# Altium schematic sheet 4_RFM95W.SchDoc
size A4; SheetNumber: 5; SheetTotal: 6
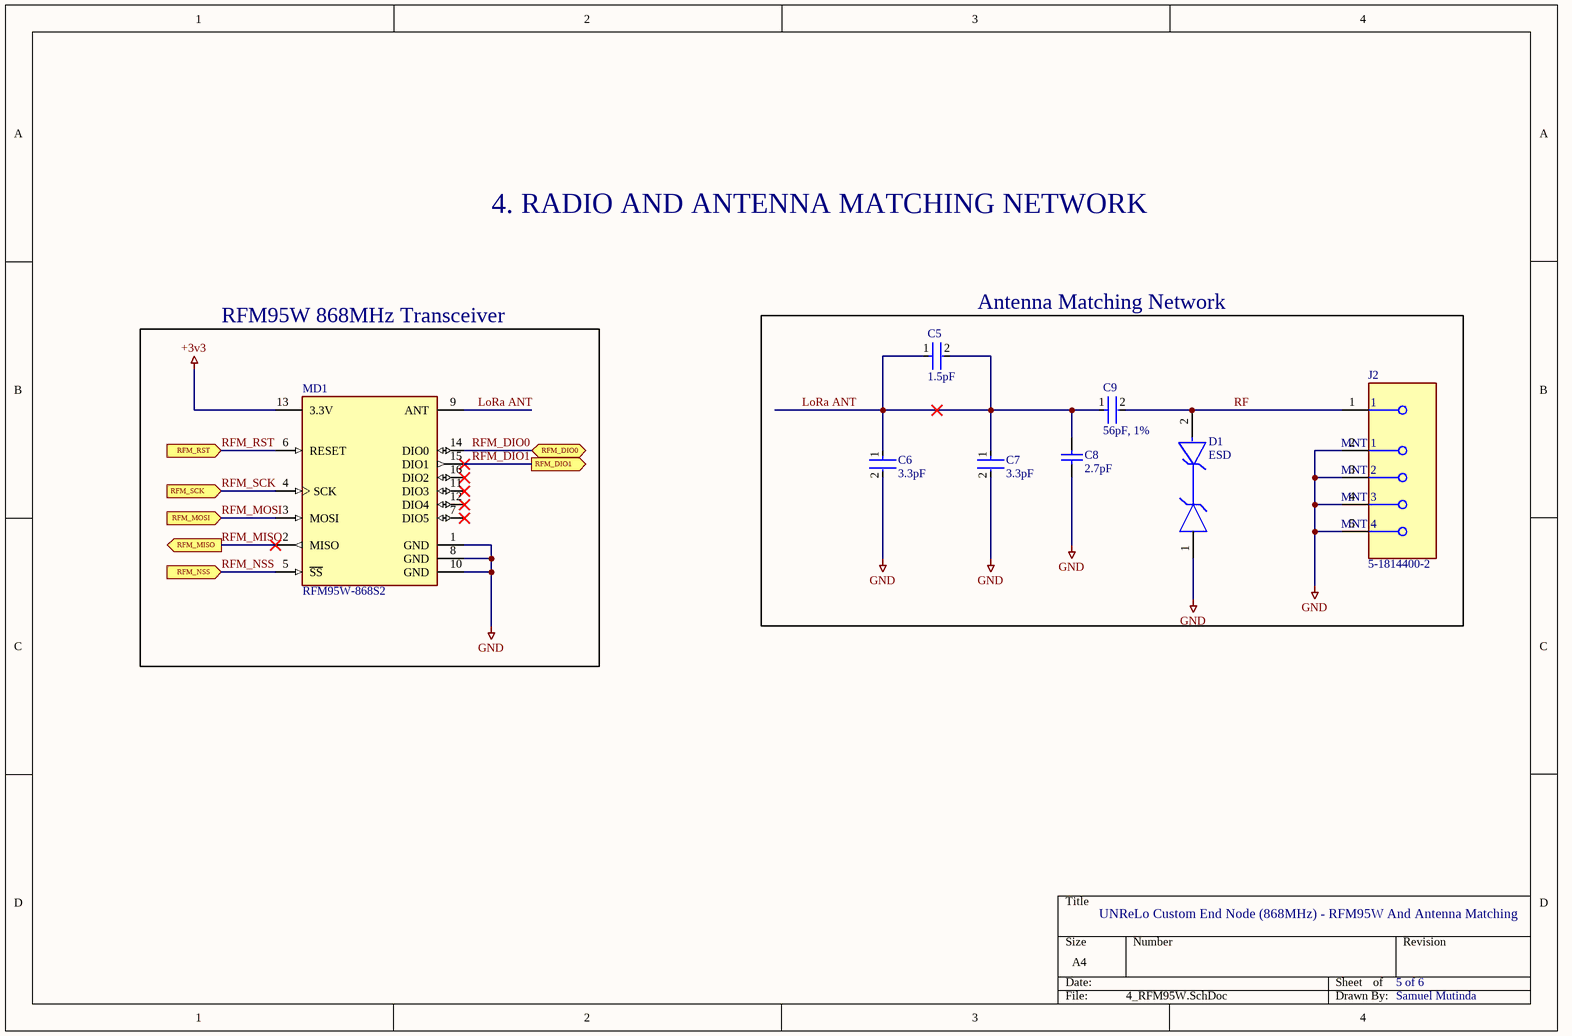
[diagram p0: 4_RFM95W.SchDoc]

## Parts
C5  1.5pF  [FP-GJM155-0_05-IPC_C]
C6  3.3pF  [FP-C0603C-CF-MFG]
C7  3.3pF  [FP-C0603C-CF-MFG]
C8  2.7pF  [CAPC1006X50X20ML10T10]
C9  56pF, 1%  [FP-C0603C-CF-MFG]
D1  ESD  [FP-711AM-CA-MFG]
J2  5-1814400-2  [FP-5-1814400-2-MFG]
MD1  RFM95W-868S2  [FP-RFM95W-868S2-MFG]

## Blocks framed on the sheet
RFM95W 868MHz Transceiver: MD1
Antenna Matching Network: C5-C9 D1 J2

## Ports
RFM_DIO0 (bidir), RFM_DIO1 (out), RFM_MISO (out), RFM_MOSI (in), RFM_NSS (in), RFM_RST (in), RFM_SCK (in)

## Nets
+3v3: MD1.13(3.3V)
GND: C6.2 C7.2 C8.1 D1.1 J2.2(MNT_1) J2.3(MNT_2) J2.4(MNT_3) J2.5(MNT_4) MD1.1(GND) MD1.8(GND) MD1.10(GND)
LoRa ANT: C5.1 C5.2 C6.1 C7.1 C8.2 C9.1 MD1.9(ANT)
RF: C9.2 D1.2 J2.1
RFM_DIO0: MD1.14(DIO0) ; port RFM_DIO0
RFM_DIO1: MD1.15(DIO1) ; port RFM_DIO1
RFM_MISO: MD1.2(MISO) ; port RFM_MISO
RFM_MOSI: MD1.3(MOSI) ; port RFM_MOSI
RFM_NSS: MD1.5(~{SS}) ; port RFM_NSS
RFM_RST: MD1.6(RESET) ; port RFM_RST
RFM_SCK: MD1.4(SCK) ; port RFM_SCK

Not connected (* = marked no-connect by the designer): MD1 7(DIO5)* 11(DIO3)* 12(DIO4)* 16(DIO2)*

## Notes on the sheet
- 4. RADIO AND ANTENNA MATCHING NETWORK
- UNReLo Custom End Node (868MHz) - RFM95W And Antenna Matching
- 5 of 6
- Samuel Mutinda

## Library data of the parts
C5 = CMP-2008-03820-2: Multi-Layer Ceramic Capacitor 1.5pF C0G  ±0.1pF 0402 Paper T/R; Manufacturer 1: KEMET; Temperature Coefficient: 30ppm/°C; Voltage Rating: 50V; Name: CBR04C159B5GAC; Depth: 0.5mm; Case Code (Imperial): 0402; Package Quantity: 10000; Length: 1mm; Number of Pins: 2; Max Operating Temperature: 125°C; Mount: Surface Mount; Construction: Flat; Thickness: 0.022inch; Series: GJM; Packaging: Tape and Reel; Radiation Hardening: No; REACH SVHC: No SVHC; Case/Package: 0402; Lead Free: Lead Free; Voltage Rating (DC): 50V; Min Operating Temperature: -55°C; Dielectric: C0G; Termination: SMD/SMT; Width: 0.5mm; Capacitance: 1.5pF; Lead Pitch: 0.3mm; Case Code (Metric): 1005; Voltage: 50V; Height: 0.5mm; Manufacturer Part Number 1: CBR04C159B5GAC; Supplier 1: Digi-Key; Supplier Part Number 1: 399-CBR04C159B5GACCT-ND; Supplier Unit Price 1: $0.17
C6 = CMP-1035-00238-3: CAP CER 3.3PF 50V NP0 0603; Manufacturer 1: KEMET; Tolerance: 0.25 pF; Material: Ceramic; Temperature Characteristic: C0G; Automotive Grade: Grade 1; Temperature Coefficient: 30ppm/°C; Name: C0603C339C5GACTU; Height: 0.87mm; Category: Cap; Automotive: Yes; Voltage Rating: 50 V; Capacitance: 3.3 pF; ComponentLink2Description: Datasheet; Octopart: https://octopart.com/c0603c339c5gactu-kemet-3701205; Temperature Range Low: -55°C; Device Class L3: Ceramic Capacitors; Package: C0603C-CF; Temperature: -55°C to +125°C; Digikey Description: CAP CER 3.3PF 50V NP0 0603; Temperature Range High: +125°C; ComponentLink2URL: https://api.kemet.com/component-edge/download/datasheet/C0603C100J5GACAUTO.pdf; Device Class L1: Passive Components; Value: 3.3 pF; RoHS: TRUE; Lead Free: Yes; Mouser Description: Multilayer Ceramic Capacitors MLCC - SMD/SMT 50volts 3.3pF C0G 0.25%; Device Class L2: Capacitors; Manufacturer Part Number 1: C0603C339C5GACTU; Supplier 1: Digi-Key; Supplier Part Number 1: 399-C0603C339C5GAC7867CT-ND; Supplier Unit Price 1: $0.34
C7 = CMP-1035-00238-3: CAP CER 3.3PF 50V NP0 0603; Manufacturer 1: KEMET; Tolerance: 0.25 pF; Material: Ceramic; Temperature Characteristic: C0G; Automotive Grade: Grade 1; Temperature Coefficient: 30ppm/°C; Name: C0603C339C5GAC7867; Height: 0.87mm; Category: Cap; Automotive: Yes; Voltage Rating: 50 V; Capacitance: 3.3 pF; ComponentLink2Description: Datasheet; Octopart: https://octopart.com/c0603c339c5gactu-kemet-3701205; Temperature Range Low: -55°C; Device Class L3: Ceramic Capacitors; Package: C0603C-CF; Temperature: -55°C to +125°C; Digikey Description: CAP CER 3.3PF 50V NP0 0603; Temperature Range High: +125°C; ComponentLink2URL: https://api.kemet.com/component-edge/download/datasheet/C0603C100J5GACAUTO.pdf; Device Class L1: Passive Components; Value: 3.3 pF; RoHS: TRUE; Lead Free: Yes; Mouser Description: Multilayer Ceramic Capacitors MLCC - SMD/SMT 50volts 3.3pF C0G 0.25%; Device Class L2: Capacitors; Manufacturer Part Number 1: C0603C339C5GAC7867; Supplier 1: Digi-Key; Supplier Part Number 1: 399-C0603C339C5GAC7867CT-ND; Supplier Unit Price 1: $0.34
C8 = CMP-2008-04788-1: Manufacturer: AVX Interconnect / Elco; Manufacturer 1: KEMET; Name: CBR04C279B5GAC; Manufacturer Part Number 1: CBR04C279B5GAC; Supplier 1: Digi-Key; Supplier Part Number 1: 399-14751-1-ND; Supplier Unit Price 1: $0.15
C9 = CMP-2006-03385-2: CAP CER 56PF 50V 1% NP0 0603; Manufacturer 1: KEMET; Material: Ceramic; Tolerance: 0.01; Temperature Coefficient: 30ppm/°C; Automotive Grade: Grade 1; Temperature Characteristic: C0G; Name: C0603C560F5GAC7867; Capacitance: 56 pF; ComponentLink2Description: Datasheet; Package: C0603C-CF; Lead Free: Yes; Digikey Description: CAP CER 56PF 50V 1% NP0 0603; Mouser Description: Multilayer Ceramic Capacitors MLCC - SMD/SMT 50volts 56pF C0G 1%; Value: 56 pF; Temperature Range High: +125°C; Category: Cap; Temperature Range Low: -55°C; RoHS: TRUE; ComponentLink2URL: https://api.kemet.com/component-edge/download/datasheet/C0603C100J5GACAUTO.pdf; Device Class L1: Passive Components; Device Class L2: Capacitors; Temperature: -55°C to +125°C; Device Class L3: Ceramic Capacitors; Height: 0.87mm; Octopart: https://octopart.com/c0603c560f5gactu-kemet-9143760; Automotive: Yes; Voltage Rating: 50 V; Manufacturer Part Number 1: C0603C560F5GAC7867; Supplier 1: Digi-Key; Supplier Part Number 1: 399-C0603C560F5GAC7867CT-ND; Supplier Unit Price 1: $0.22
D1 = CMP-07200-000004-1: TVS DIODE 5.3V 2XDFN; Manufacturer 1: onsemi; Direction: Bidirectional; Number Of Channels: 1; Max Junction Temp: +150°C; Breakdown Voltage: 7V; Automotive Grade: Grade 0; Capacitance: 0.24pF; Clamping Voltage: 13V; Value: 0.24pF; Name: SZESD7471N2T5G; Package: 711AM-CA; Digikey Description: TVS DIODE 5.3V 2XDFN; Device Class L1: Circuit Protection; Automotive: Yes; Device Class L3: unset; ComponentLink2Description: Datasheet; Temperature Range High: +150°C; Height: 0.44mm; Device Class L2: TVS Diodes; Reverse Standoff Voltage: 5.3V; RoHS: TRUE; Mouser Description: Ultra-Low Capacitance ESD Protection low cap ESD protection in SOD-882; ComponentLink2URL: https://datasheet.octopart.com/SZESD7471N2T5G-ON-Semiconductor-datasheet-32011129.pdf; Temperature: -55°C to +150°C; Lead Free: Yes; Temperature Range Low: -55°C; Category: Diode; Footprint Url: https://www.onsemi.com/pub/Collateral/711AM.PDF; Octopart: https://octopart.com/szesd7471n2t5g-on+semiconductor-47358903; Manufacturer Part Number 1: SZESD7471N2T5G; Supplier 1: Digi-Key; Supplier Part Number 1: SZESD7471N2T5GOSCT-ND; Supplier Unit Price 1: $0.43
J2 = CMP-03357-000009-1: CONN SMA JACK R/A 50 OHM PCB; Manufacturer 1: TE Connectivity AMP Connectors; Name: 5-1814400-2; Manufacturer Part Number 1: 5-1814400-2; Supplier 1: Digi-Key; Supplier Part Number 1: 17-5-1814400-2CT-ND; Supplier Unit Price 1: $4.54
MD1 = CMP-204316-000001-1: RX TXRX MODULE ISM < 1GHZ SMD; Manufacturer 1: HOPEMICROELECTRONICS; Data Rate: 300Kbps; Frequency: 868MHz; Sensitivity: -123dBm; Interface: SPI; Current - Transmitting: 120mA; Current - Receiving: 12.1mA; Name: RFM95W-868S2R; Max Operating Temperature: 70°C; Case/Package: SMD/SMT; Packaging: Bulk; Mount: Surface Mount; Min Operating Temperature: -20°C; Manufacturer Part Number 1: RFM95W-868S2R; Supplier 1: Digi-Key; Supplier Part Number 1: RFM95W-868S2R; Supplier Unit Price 1: $8.24